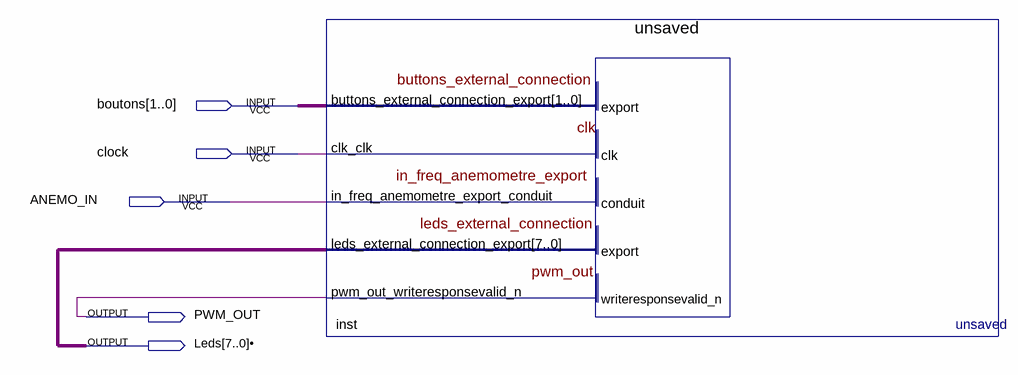
[diagram p0: schematic sheet]
// Quartus schematic sopc_compteur.bdf as structural Verilog: 1 symbols, 5 pins
module sopc_compteur (
  input  [1:0] boutons,
  input  clock,
  input  ANEMO_IN,
  output PWM_OUT,
  output \Leds[7..0]• 
);

  wire [7:0] inst_leds_external_connection_export;

  unsaved inst (
    .buttons_external_connection_export(boutons), .clk_clk(clock),
    .in_freq_anemometre_export_conduit(ANEMO_IN),
    .leds_external_connection_export(inst_leds_external_connection_export),
    .pwm_out_writeresponsevalid_n(PWM_OUT));
endmodule
